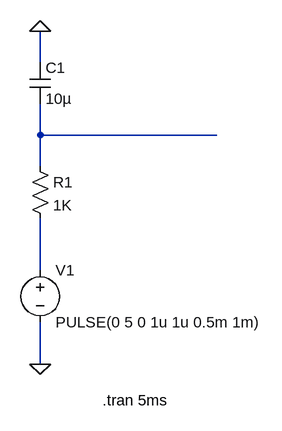
[diagram p0: schematic PartC_PWM(Digital-AnalogConversion using PWM+RC Filter).asc]
PartC_PWM(Digital-AnalogConversion using PWM+RC Filter).asc, the LTspice schematic file:
Version 4.1
SHEET 1 880 680
WIRE 16 -208 16 -256
WIRE 16 -96 16 -144
WIRE 288 -96 16 -96
WIRE 16 -48 16 -96
WIRE 16 112 16 32
WIRE 16 256 16 192
FLAG 16 256 0
FLAG 16 -256 0
SYMBOL voltage 16 96 R0
WINDOW 123 0 0 Left 0
WINDOW 39 0 0 Left 0
SYMATTR InstName V1
SYMATTR Value PULSE(0 5 0 1u 1u 0.5m 1m)
SYMBOL res 0 -64 R0
SYMATTR InstName R1
SYMATTR Value 1K
SYMBOL cap 0 -208 R0
SYMATTR InstName C1
SYMATTR Value 10µ
TEXT 112 312 Left 2 !.tran 5ms

The netlist it stands for:
* PartC_PWM(Digital-AnalogConversion using PWM+RC Filter).asc
V1 N002 0 PULSE(0 5 0 1u 1u 0.5m 1m)
R1 N001 N002 1K
C1 0 N001 10µ
.tran 5ms
.backanno
.end